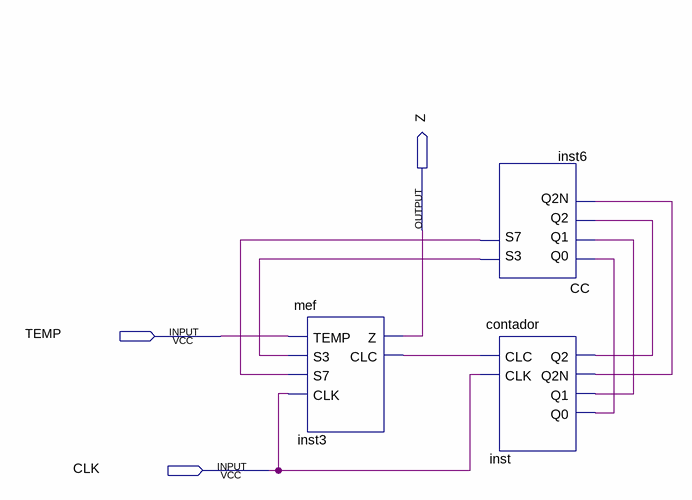
[diagram p0: schematic sheet]
// Quartus schematic q42.bdf as structural Verilog: 3 symbols, 3 pins
module q42 (
  input  TEMP,
  input  CLK,
  output Z
);

  wire inst3_clc, inst6_s3, inst6_s7, inst_q0, inst_q1, inst_q2, inst_q2n;

  mef inst3 (.TEMP(TEMP), .S3(inst6_s3), .S7(inst6_s7), .CLK(CLK), .Z(Z), .CLC(inst3_clc));
  CC inst6 (.Q0(inst_q0), .Q1(inst_q1), .Q2(inst_q2), .Q2N(inst_q2n), .S3(inst6_s3), .S7(inst6_s7));
  contador inst (.CLC(inst3_clc), .CLK(CLK), .Q2(inst_q2), .Q2N(inst_q2n), .Q1(inst_q1), .Q0(inst_q0));
endmodule
